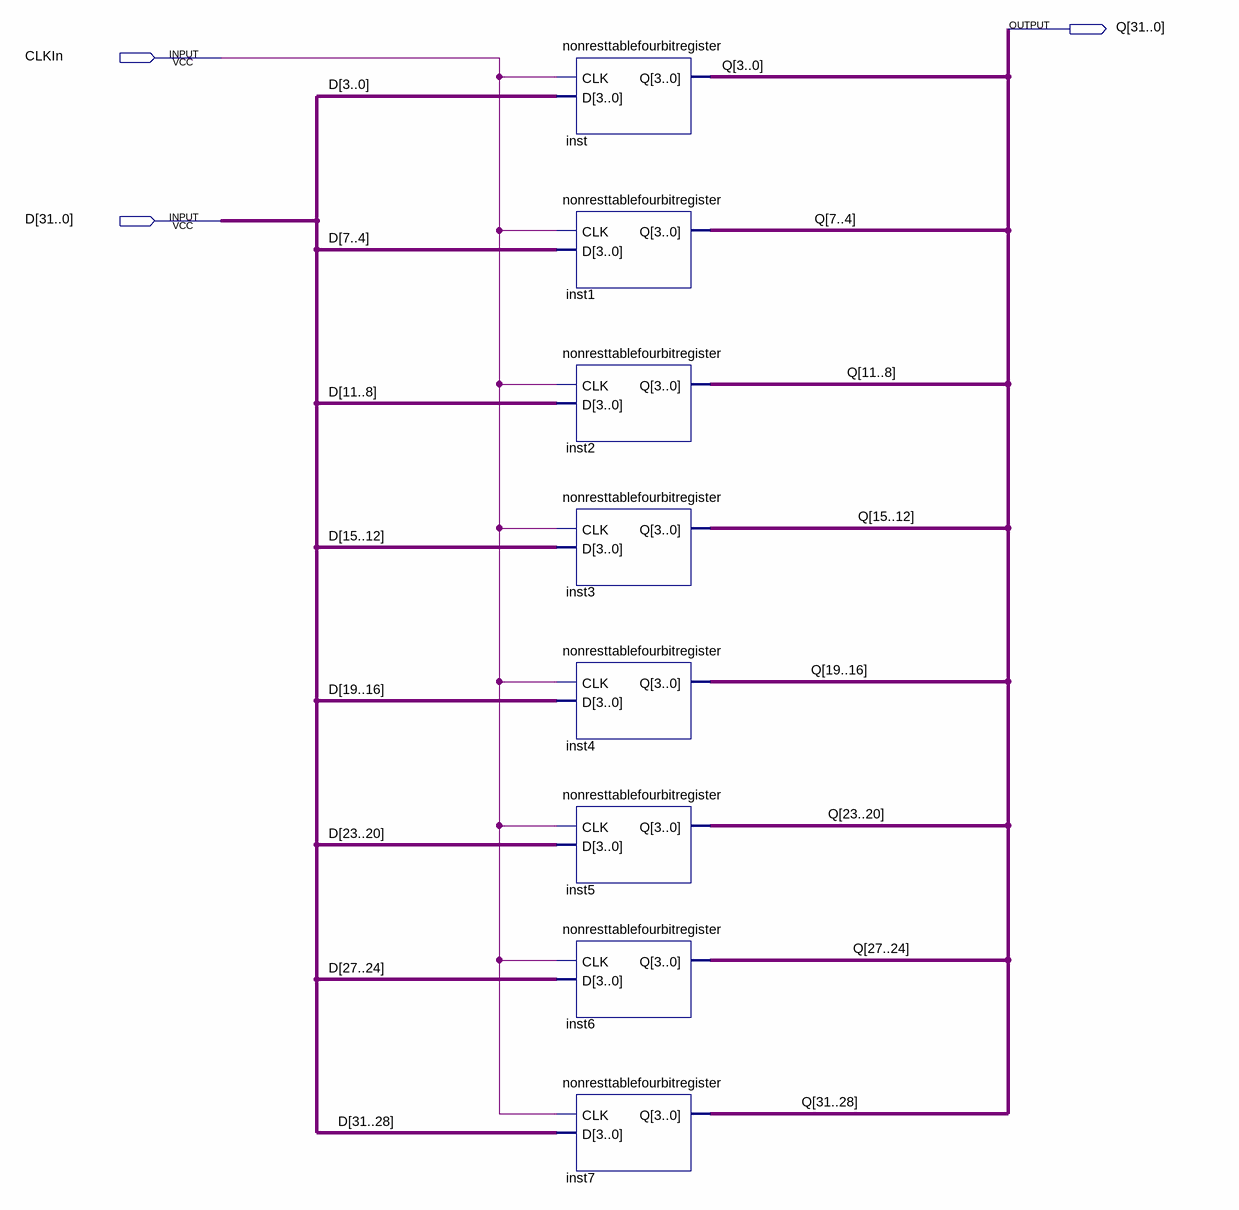
[diagram p0: schematic sheet]
// Quartus schematic nonresetablethirtytworegister.bdf as structural Verilog: 8 symbols, 3 pins
module nonresetablethirtytworegister (
  input  CLKIn,
  input  [31:0] D,
  output [31:0] Q
);

  nonresttablefourbitregister inst (.CLK(CLKIn), .D(D[3:0]), .Q(Q[3:0]));
  nonresttablefourbitregister inst1 (.CLK(CLKIn), .D(D[7:4]), .Q(Q[7:4]));
  nonresttablefourbitregister inst2 (.CLK(CLKIn), .D(D[11:8]), .Q(Q[11:8]));
  nonresttablefourbitregister inst3 (.CLK(CLKIn), .D(D[15:12]), .Q(Q[15:12]));
  nonresttablefourbitregister inst4 (.CLK(CLKIn), .D(D[19:16]), .Q(Q[19:16]));
  nonresttablefourbitregister inst5 (.CLK(CLKIn), .D(D[23:20]), .Q(Q[23:20]));
  nonresttablefourbitregister inst6 (.CLK(CLKIn), .D(D[27:24]), .Q(Q[27:24]));
  nonresttablefourbitregister inst7 (.CLK(CLKIn), .D(D[31:28]), .Q(Q[31:28]));
endmodule
